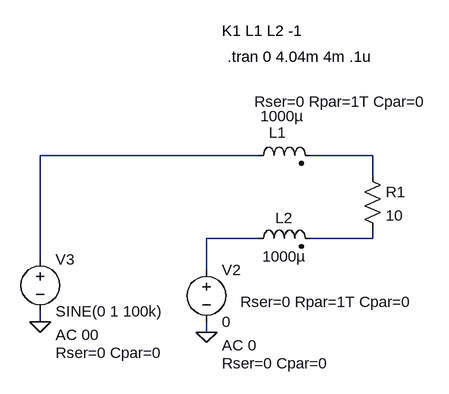
[diagram p0: schematic Common Mode Choke2.asc]
Common Mode Choke2.asc, the LTspice schematic file:
Version 4
SHEET 1 880 680
WIRE 128 -16 -208 -16
WIRE 304 -16 208 -16
WIRE 304 16 304 -16
WIRE 128 112 48 112
WIRE 304 112 304 96
WIRE 304 112 208 112
WIRE -208 144 -208 -16
WIRE 48 160 48 112
WIRE -208 240 -208 224
WIRE 48 256 48 240
FLAG -208 240 0
FLAG 48 256 0
SYMBOL ind2 112 0 R270
WINDOW 0 51 32 VRight 0
WINDOW 3 77 19 VRight 0
WINDOW 39 99 10 VRight 0
SYMATTR InstName L1
SYMATTR Value 1000µ
SYMATTR SpiceLine Rser=0 Rpar=1T Cpar=0
SYMATTR Type ind
SYMBOL ind2 112 128 R270
WINDOW 0 32 56 VTop 0
WINDOW 3 4 56 VBottom 0
WINDOW 39 -66 122 VBottom 0
SYMATTR InstName L2
SYMATTR Value 1000µ
SYMATTR Type ind
SYMATTR SpiceLine Rser=0 Rpar=1T Cpar=0
SYMBOL res 288 0 R0
SYMATTR InstName R1
SYMATTR Value 10
SYMBOL voltage 48 144 R0
WINDOW 123 24 132 Left 0
WINDOW 39 24 160 Left 0
SYMATTR InstName V2
SYMATTR Value 0
SYMATTR Value2 AC 0
SYMATTR SpiceLine Rser=0 Cpar=0
SYMBOL voltage -208 128 R0
WINDOW 123 24 132 Left 0
WINDOW 39 24 160 Left 0
SYMATTR InstName V3
SYMATTR Value SINE(0 1 100k)
SYMATTR Value2 AC 00
SYMATTR SpiceLine Rser=0 Cpar=0
TEXT 72 -208 Left 0 !K1 L1 L2 -1
TEXT 80 -168 Left 0 !.tran 0 4.04m 4m .1u

The netlist it stands for:
* Common Mode Choke2.asc
L1 N001 N002 1000µ Rser=0 Rpar=1T Cpar=0
L2 N003 N004 1000µ Rser=0 Rpar=1T Cpar=0
R1 N002 N004 10
V2 N003 0 0 AC 0 Rser=0 Cpar=0
V3 N001 0 SINE(0 1 100k) AC 00 Rser=0 Cpar=0
K1 L1 L2 -1
.tran 0 4.04m 4m .1u
.backanno
.end